# Altium project wind_monitor_v2.PrjPcb (part 3 of 3)

## Sheet connections.SchDoc
size A4; SheetNumber: 3; SheetTotal: 4
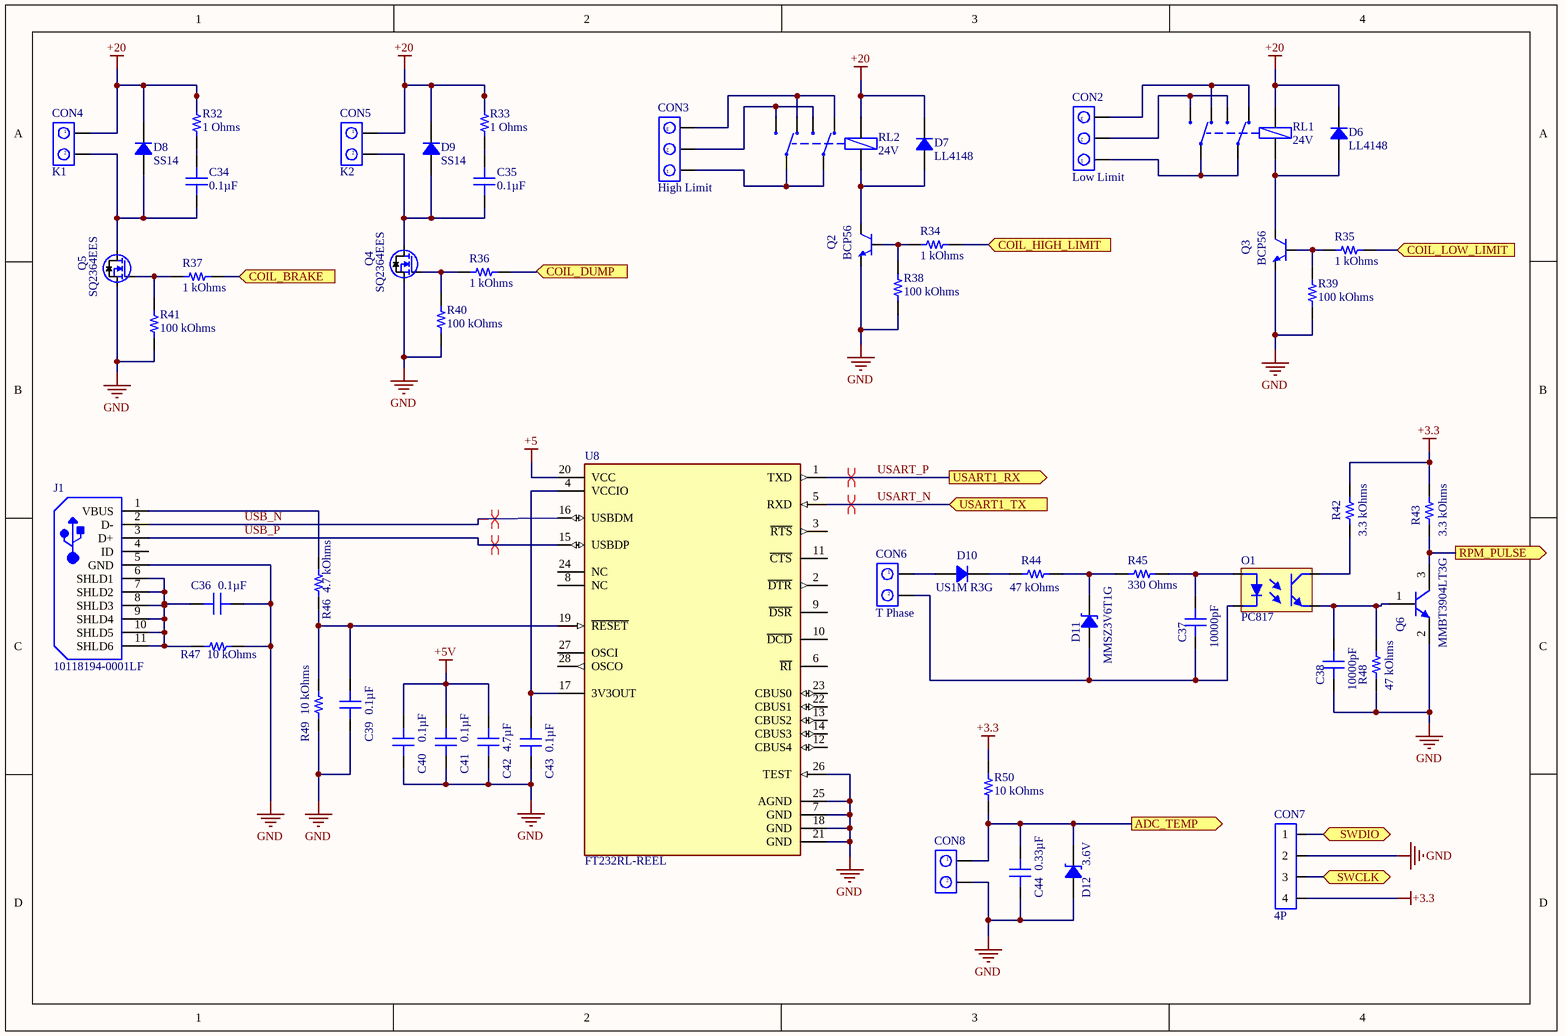
[diagram p2: connections.SchDoc]

### Parts
C34  0.1µF  [CAP 0805_2012]
C35  0.1µF  [CAP 0805_2012]
C36  0.1µF  [CAP 0402_1005]
C37  10000pF  [CAP 0805_2012]
C38  10000pF  [CAP 0805_2012]
C39  0.1µF  [CAP 0402_1005]
C40  0.1µF  [CAP 0402_1005]
C41  0.1µF  [CAP 0402_1005]
C42  4.7µF  [CAP 1206_3216 - 1.0MM]
C43  0.1µF  [CAP 0402_1005]
C44  0.33µF  [CAP 0805_2012]
CON2  Low Limit  [DG301-5.0-03P-12-00AH]
CON3  High Limit  [DG301-5.0-03P-12-00AH]
CON4  K1  [DG301-5.0-02P-12-00AH]
CON5  K2  [DG301-5.0-02P-12-00AH]
CON6  T Phase  [DG301-5.0-02P-12-00AH]
CON7  4P  [Single_THT_4P_2.54Pitch_6Height_180C]
CON8  DG301-5.0-02P-12-00AH  [DG301-5.0-02P-12-00AH]  (value not drawn)
D6  LL4148  [SOD-80 MiniMELF]
D7  LL4148  [SOD-80 MiniMELF]
D8  SS14  [DO214AC SMA]
D9  SS14  [DO214AC SMA]
D10  US1M R3G  [DO214AC SMA]
D11  MMSZ3V6T1G  [SOD-123]
D12  3.6V  [SOD-123]
J1  10118194-0001LF  [FCI-10118194-0001LF-5_V]
O1  PC817  [SMD-4]
Q2  BCP56  [SOT-223]
Q3  BCP56  [SOT-223]
Q4  SQ2364EES  [SOT23-(SQ2364EES)_H]
Q5  SQ2364EES  [SOT23-(SQ2364EES)_H]
Q6  MMBT3904LT3G  [ON SEMI SOT-23-3]
R32  1 Ohms  [RES 1206_3216]
R33  1 Ohms  [RES 1206_3216]
R34  1 kOhms  [RES 1206_3216]
R35  1 kOhms  [RES 1206_3216]
R36  1 kOhms  [RES 1206_3216]
R37  1 kOhms  [RES 1206_3216]
R38  100 kOhms  [RES 1206_3216]
R39  100 kOhms  [RES 1206_3216]
R40  100 kOhms  [RES 1206_3216]
R41  100 kOhms  [RES 1206_3216]
R42  3.3 kOhms  [RES 1206_3216]
R43  3.3 kOhms  [RES 1206_3216]
R44  47 kOhms  [RES 1206_3216]
R45  330 Ohms  [RES 1206_3216]
R46  4.7 kOhms  [RES 1206_3216]
R47  10 kOhms  [RES 1206_3216]
R48  47 kOhms  [RES 1206_3216]
R49  10 kOhms  [RES 1206_3216]
R50  10 kOhms  [RES 1206_3216]
RL1  24V  [HJR1-2C-L-24VDC-S-ZY]
RL2  24V  [HJR1-2C-L-24VDC-S-ZY]
U8  FT232RL-REEL  [FP-SSOP-28-IPC_B]

### Ports
ADC_TEMP (out), COIL_BRAKE (in), COIL_DUMP (in), COIL_HIGH_LIMIT (in), COIL_LOW_LIMIT (in), RPM_PULSE (out), SWCLK (bidir), SWDIO (bidir), USART1_RX (out), USART1_TX (in)

### Nets
+3.3: CON7.4 R42.2 R43.2 R50.2
+5: U8.20(VCC)
+5V: C40.2 C41.2 C42.2
+20: CON4.1 CON5.1 D6.2 D7.2 D8.2 D9.2 R32.2 R33.2 RL1.1(LEDK) RL2.1(LEDK)
GND: C36.1 C38.1 C39.1 C40.1 C41.1 C42.1 C43.1 C44.1 CON7.2 CON8.2 D12.1 J1.5(GND) Q2.3(E) Q3.3(E) Q4.2(S) Q5.2(S) Q6.2(E) R38.1 R39.1 R40.1 R41.1 R47.1 R48.1 R49.1 U8.7(GND) U8.18(GND) U8.21(GND) U8.25(AGND) U8.26(TEST)
USART_N: U8.5(RXD) ; port USART1_TX
USART_P: U8.1(TXD) ; port USART1_RX
USB_N: J1.2(D-) U8.16(USBDM)
USB_P: J1.3(D+) U8.15(USBDP)
NetC34_1: C34.1 CON4.2 D8.1 Q5.3(D)
NetC34_2: C34.2 R32.1
NetC35_1: C35.1 CON5.2 D9.1 Q4.3(D)
NetC35_2: C35.2 R33.1
NetC36_2: C36.2 J1.6(SHLD1) J1.7(SHLD2) J1.8(SHLD3) J1.9(SHLD4) J1.10(SHLD5) J1.11(SHLD6) R47.2
NetC37_1: C37.1 CON6.2 D11.1 O1.2
NetC37_2: C37.2 O1.1 R45.2
NetC38_2: C38.2 O1.3 Q6.1(B) R48.2
NetC39_2: C39.2 R46.1 R49.2 U8.19(~{RESET})
NetC43_2: C43.2 U8.4(VCCIO) U8.17(3V3OUT)
NetC44_2: C44.2 CON8.1 D12.2 R50.1 ; port ADC_TEMP
NetCON2_1: CON2.1 RL1.4 RL1.13
NetCON2_2: CON2.2 RL1.8 RL1.9
NetCON2_3: CON2.3 RL1.6 RL1.11
NetCON3_1: CON3.1 RL2.4 RL2.13
NetCON3_2: CON3.2 RL2.8 RL2.9
NetCON3_3: CON3.3 RL2.6 RL2.11
NetCON6_1: CON6.1 D10.1
NetCON7_1: CON7.1 ; port SWDIO
NetCON7_3: CON7.3 ; port SWCLK
NetD6_1: D6.1 Q3.2,4(C) RL1.16(LEDK)
NetD7_1: D7.1 Q2.2,4(C) RL2.16(LEDK)
NetD10_2: D10.2 R44.1
NetD11_2: D11.2 R44.2 R45.1
NetJ1_1: J1.1(VBUS) R46.2
NetO1_4: O1.4 R42.1
NetQ2_1: Q2.1(B) R34.1 R38.2
NetQ3_1: Q3.1(B) R35.1 R39.2
NetQ4_1: Q4.1(G) R36.1 R40.2
NetQ5_1: Q5.1(G) R37.1 R41.2
NetQ6_3: Q6.3(C) R43.1 ; port RPM_PULSE
NetR34_2: R34.2 ; port COIL_HIGH_LIMIT
NetR35_2: R35.2 ; port COIL_LOW_LIMIT
NetR36_2: R36.2 ; port COIL_DUMP
NetR37_2: R37.2 ; port COIL_BRAKE

Not connected (* = marked no-connect by the designer): J1 4(ID); U8 2(~{DTR}) 3(~{RTS}) 6(~{RI}) 8(NC) 9(~{DSR}) 10(~{DCD}) 11(~{CTS}) 12(CBUS4) 13(CBUS2) 14(CBUS3) 22(CBUS1) 23(CBUS0) 24(NC) 27(OSCI) 28(OSCO)

### Layout directives
differential pair; differential pair class usb: USB_N, USB_P
differential pair; differential pair class usart: USART_N, USART_P

### Library data of the parts
C34 C35 = AS0805KKX7R0BB104: CAP CER 0.1UF 100V X7R 0805; Manufacturer: Yageo; Tolerance: ±10%; Part Number: AS0805KKX7R0BB104; Value: 0.1µF; Applications: Automotive, Boardflex Sensitive; Capacitance: 0.1µF; ComponentLink1Description: Datasheet; ComponentLink1URL: http://www.yageo.com/NewPortal/yageodocoutput?fileName=/pdf/MLCC/UPY-AS_X7R_16V-to-630V_0.pdf; ComponentLink2Description: DigiKey Link; ComponentLink2URL: http://digikey.com/product-detail/en/yageo/AS0805KKX7R0BB104/311-4581-1-ND/8605488; Device Package: 0805 (2012 Metric); Features: Soft Termination; LastUpdated: 9/2/2020 1:04:41 AM; Lifecycle Status: Active; Minimum Order: 1; Mounting Type: Surface Mount, MLCC; Operating Temperature: -55°C ~ 125°C; Package / Case: 0805 (2012 Metric); Packaging: TapeAndReel; PartId: 2704; Part Status: Active; Price: 0.08; Ratings: AEC-Q200; Series: AS; Size / Dimension: 0.079" L x 0.049" W (2.00mm x 1.25mm); Supplier 1: DigiKey; Supplier Part Number 1: 311-4581-1-ND; Temperature Coefficient: X7R; Thickness (Max): 0.057" (1.45mm); Voltage - Rated: 100V
C36 C39-C41 C43 = C0402C104M4RACTU: CAP CER 0.1UF 16V X7R 0402; Manufacturer: KEMET; Tolerance: ±20%; Part Number: C0402C104M4RACTU; Value: 0.1µF; Applications: Bypass, Decoupling; Capacitance: 0.1µF; ComponentLink1Description: Datasheet; ComponentLink1URL: https://api.kemet.com/component-edge/download/datasheet/C0402C104M4RACTU.pdf; ComponentLink2Description: DigiKey Link; ComponentLink2URL: http://digikey.com/product-detail/en/kemet/C0402C104M4RACTU/399-7763-1-ND/3471486; Device Package: 0402 (1005 Metric); LastUpdated: 9/2/2020 1:02:24 AM; Lifecycle Status: Active; Minimum Order: 1; Mounting Type: Surface Mount, MLCC; Operating Temperature: -55°C ~ 125°C; Package / Case: 0402 (1005 Metric); Packaging: TapeAndReel; PartId: 2095; Part Status: Active; Price: 0.02; Series: SMD Comm X7R; Size / Dimension: 0.039" L x 0.020" W (1.00mm x 0.50mm); Supplier 1: DigiKey; Supplier Part Number 1: 399-7763-1-ND; Temperature Coefficient: X7R; Thickness (Max): 0.022" (0.55mm); Voltage - Rated: 16V
C37 C38 = C0805X103K1RAC3316: CAP CER 0805 10NF 100V X7R; Manufacturer: KEMET; Tolerance: ±10%; Part Number: C0805X103K1RAC3316; Value: 10000pF; Applications: Automotive, Boardflex Sensitive; Capacitance: 10000pF; ComponentLink1Description: Datasheet; ComponentLink1URL: https://api.kemet.com/component-edge/download/datasheet/C0805X103K1RAC3316.pdf; ComponentLink2Description: DigiKey Link; ComponentLink2URL: http://digikey.com/product-detail/en/kemet/C0805X103K1RAC3316/399-C0805X103K1RAC3316CT-ND/10315836; Device Package: 0805 (2012 Metric); Features: Soft Termination; LastUpdated: 9/2/2020 1:04:42 AM; Lifecycle Status: Active; Minimum Order: 1; Mounting Type: Surface Mount, MLCC; Operating Temperature: -55°C ~ 125°C; Package / Case: 0805 (2012 Metric); Packaging: TapeAndReel; PartId: 2565; Part Status: Active; Price: 0.02; Ratings: AEC-Q200; Series: SMD Auto X7R VW80808; Size / Dimension: 0.079" L x 0.049" W (2.00mm x 1.25mm); Supplier 1: DigiKey; Supplier Part Number 1: 399-C0805X103K1RAC3316CT-ND; Temperature Coefficient: X7R; Thickness (Max): 0.039" (0.98mm); Voltage - Rated: 100V
C42 = C3216X7R1E475K085AB: CAP CER 4.7UF 25V X7R 1206; Manufacturer: TDK Corporation; Tolerance: ±10%; Part Number: C3216X7R1E475K085AB; Value: 4.7µF; Applications: General Purpose; Capacitance: 4.7µF; ComponentLink1Description: Datasheet; ComponentLink1URL: https://product.tdk.com/info/en/catalog/datasheets/mlcc_commercial_general_en.pdf?ref_disty=digikey; ComponentLink2Description: DigiKey Link; ComponentLink2URL: http://digikey.com/product-detail/en/tdk-corporation/C3216X7R1E475K085AB/445-14797-1-ND/3956463; Device Package: 1206 (3216 Metric); Features: Low ESL; LastUpdated: 9/2/2020 1:05:06 AM; Lifecycle Status: Active; Minimum Order: 1; Mounting Type: Surface Mount, MLCC; Operating Temperature: -55°C ~ 125°C; Package / Case: 1206 (3216 Metric); Packaging: TapeAndReel; PartId: 19105; Part Status: Active; Price: 0.08; Series: C; Size / Dimension: 0.126" L x 0.063" W (3.20mm x 1.60mm); Supplier 1: DigiKey; Supplier Part Number 1: 445-14797-1-ND; Temperature Coefficient: X7R; Thickness (Max): 0.039" (1.00mm); Voltage - Rated: 25V
C44 = C0805C334K5RECAUTO: CAP CER 0805 330NF 50V X7R 10%; Manufacturer: KEMET; Part Number: C0805C334K5RECAUTO; Value: 0.33µF; Applications: Automotive, ESD Protection; Capacitance: 0.33µF; ComponentLink1Description: Datasheet; ComponentLink1URL: https://api.kemet.com/component-edge/download/datasheet/C0805C334K5RECAUTO.pdf; ComponentLink2Description: DigiKey Link; ComponentLink2URL: http://digikey.com/product-detail/en/kemet/C0805C334K5RECAUTO/399-17888-1-ND/8640555; Device Package: 0805 (2012 Metric); LastUpdated: 9/2/2020 1:04:15 AM; Lifecycle Status: Active; Minimum Order: 1; Mounting Type: Surface Mount, MLCC; Operating Temperature: -55°C ~ 125°C; Package / Case: 0805 (2012 Metric); Packaging: TapeAndReel; PartId: 15715; Part Status: Active; Price: 0.05; Ratings: AEC-Q200; Series: ESD SMD Auto X7R; Size / Dimension: 0.079" L x 0.049" W (2.00mm x 1.25mm); Supplier 1: DigiKey; Supplier Part Number 1: 399-17888-1-ND; Temperature Coefficient: X7R; Thickness (Max): 0.039" (1.00mm); Tolerance: ±10%; Voltage - Rated: 50V
CON2 CON3 = DG301-5.0-03P-12-00AH
CON4-CON6 = DG301-5.0-02P-12-00AH
CON7 = Single 4P 2.54mm
D6 D7 = LL4148: DIODE GEN PURP 100V 200MA SOD80; Manufacturer: ON Semiconductor; Current - Reverse Leakage @ Vr: 25nA @ 20V; Diode Type: Standard; Reverse Recovery Time (trr): 4ns; Speed: Small Signal =< 200mA (Io), Any Speed; Voltage - Forward (Vf) (Max) @ If: 1V @ 10mA; Part Number: LL4148; ComponentLink1Description: Datasheet; ComponentLink1URL: https://www.onsemi.com/pub/Collateral/LL4148-D.pdf; ComponentLink2Description: DigiKey Link; ComponentLink2URL: http://digikey.com/product-detail/en/on-semiconductor/LL4148/LL4148FSCT-ND/1923118; Current - Average Rectified (Io): 200mA; LastUpdated: 9/2/2020 1:23:17 AM; Lifecycle Status: Active; Minimum Order: 1; Mounting Type: Surface Mount; Operating Temperature - Junction: -55°C ~ 175°C; Package / Case: DO-213AC, MINI-MELF, SOD-80; Packaging: TapeAndReel; PartId: 2621; Part Status: Active; Price: 0.02; Series: -; Supplier 1: DigiKey; Supplier Part Number 1: LL4148FSCT-ND; Supplier Device Package: SOD-80; Voltage - DC Reverse (Vr) (Max): 100V
D8 D9 = SS14: DIODE SCHOTTKY 40V 1A SMA; Manufacturer: ON Semiconductor; Current - Reverse Leakage @ Vr: 200µA @ 40V; Speed: Fast Recovery =< 500ns, > 200mA (Io); Voltage - Forward (Vf) (Max) @ If: 500mV @ 1A; Part Number: SS14; ComponentLink1Description: Datasheet; ComponentLink1URL: https://www.onsemi.com/pub/Collateral/SS19-D.PDF; ComponentLink2Description: DigiKey Link; ComponentLink2URL: http://digikey.com/product-detail/en/on-semiconductor/SS14/SS14CT-ND/965729; Current - Average Rectified (Io): 1A; Diode Type: Schottky; LastUpdated: 9/2/2020 1:19:04 AM; Lifecycle Status: Active; Minimum Order: 1; Mounting Type: Surface Mount; Operating Temperature - Junction: -65°C ~ 125°C; Package / Case: DO-214AC, SMA; Packaging: TapeAndReel; PartId: 1885; Part Status: Active; Price: 0.06; Series: -; Supplier 1: DigiKey; Supplier Part Number 1: SS14CT-ND; Supplier Device Package: SMA (DO-214AC); Voltage - DC Reverse (Vr) (Max): 40V
D10 = US1M R3G: DIODE GEN PURP 1KV 1A DO214AC; Manufacturer: Taiwan Semiconductor Corporation; Capacitance @ Vr, F: 10pF @ 4V, 1MHz; Current - Reverse Leakage @ Vr: 5µA @ 1000V; Diode Type: Standard; Reverse Recovery Time (trr): 75ns; Speed: Fast Recovery =< 500ns, > 200mA (Io); Voltage - DC Reverse (Vr) (Max): 1000V; Voltage - Forward (Vf) (Max) @ If: 1.7V @ 1A; Part Number: US1M R3G; ComponentLink1Description: Datasheet; ComponentLink1URL: https://www.taiwansemi.com/products/datasheet/US1A%20SERIES_M15.pdf; ComponentLink2Description: DigiKey Link; ComponentLink2URL: http://digikey.com/product-detail/en/taiwan-semiconductor-corporation/US1M-R3G/US1MR3GCT-ND/7360852; Current - Average Rectified (Io): 1A; LastUpdated: 9/2/2020 1:19:04 AM; Lifecycle Status: Active; Minimum Order: 1; Mounting Type: Surface Mount; Operating Temperature - Junction: -55°C ~ 150°C; Package / Case: DO-214AC, SMA; Packaging: TapeAndReel; PartId: 605; Part Status: Active; Price: 0.08; Series: -; Supplier 1: DigiKey; Supplier Part Number 1: US1MR3GCT-ND; Supplier Device Package: DO-214AC (SMA)
D11 D12 = MMSZ3V6T1G: DIODE ZENER 3.6V 500MW SOD123; Manufacturer: ON Semiconductor; Current - Reverse Leakage @ Vr: 5µA @ 1V; Impedance (Max) (Zzt): 90 Ohms; Tolerance: ±5%; Voltage - Forward (Vf) (Max) @ If: 900mV @ 10mA; Part Number: MMSZ3V6T1G; ComponentLink1Description: Datasheet; ComponentLink1URL: http://www.onsemi.com/pub/Collateral/MMSZ2V4T1-D.PDF; ComponentLink2Description: DigiKey Link; ComponentLink2URL: http://digikey.com/product-detail/en/on-semiconductor/MMSZ3V6T1G/MMSZ3V6T1GOSCT-ND/2121110; LastUpdated: 9/2/2020 1:19:27 AM; Lifecycle Status: Active; Minimum Order: 1; Mounting Type: Surface Mount; Operating Temperature: -55°C ~ 150°C; Package / Case: SOD-123; Packaging: TapeAndReel; PartId: 1892; Part Status: Active; Power - Max: 500mW; Price: 0.04; Series: -; Supplier 1: DigiKey; Supplier Part Number 1: MMSZ3V6T1GOSCT-ND; Supplier Device Package: SOD-123; Voltage - Zener (Nom) (Vz): 3.6V
J1 = KLS1-238: Micro USB B Type Receptacle, 1.8 A, -55 to 85 degC, 5-Pin SMD, RoHS, Tape and Reel; Manufacturer: Amphenol FCI; Body Orientation: RightAngle; Number of Contacts: 5; Pitch: 0.65mm; Gender: RCP; Rad Hard: No; Package Reference: 10118194-0001LF-5; Mounting: SurfaceMount; Manufacturer URL: http://www.fci.com/; Packaging: CutTape; Datasheet URL: https://datasheet.ciiva.com/26945/getdatasheetpartid-418619-26945695.pdf; Termination Method: Solder; Package Description: 5-Pin Surface Mount Device, Body 8.05 x 5.53 mm, Pitch 0.65 mm; Type: MicroUSBTypeB; Datasheet Version: Rev. A, 10/2011
O1 = PC817A: Optoisolator Transistor Output 5000Vrms 1 Channel 4-DIP; MF: Taiwan Semiconductor; Availability: Unavailable; Package: DIP-4 Taiwan Semiconductor; SnapEDA_Link: https://www.snapeda.com/parts/PC817A/Taiwan%20Semiconductor%20Corporation/view-part/2178336/?ref=snap; MP: PC817A; Price: None; Value: *
Q2 Q3 = BCP56-16T1G: Trans GP BJT NPN 80V 1A Automotive 4-Pin(3+Tab) SOT-223 T/R; Manufacturer: ON Semiconductor; Max Power Dissipation: 1.5W; Collector Base Voltage (VCBO): 100V; Emitter Base Voltage (VEBO): 5V; Element Configuration: Single; Collector Emitter Saturation Voltage: 500mV; Transition Frequency: 130MHz; Number of Elements: 1; hFE Min: 25; Supplier 1: Digi-Key; Manufacturer Part Number: BCP56-16T1G; RoHS: Yes; Category: BJTs; Stock 1: 31080; Pricing 1: 1=0.48000, 10=0.33400, 25=0.31080, 100=0.16880, 500=0.13768 (USD); Case/Package: SOT-223-4; Number of Pins: 4; Contact Plating: Tin,Matte; Min Operating Temperature: -65°C; Max Operating Temperature: 150°C; Packaging: Tape and Reel; Collector Emitter Voltage (VCEO): 80V; Max Collector Current: 1A; Polarity: NPN; Package Quantity: 1000; Collector Emitter Breakdown Voltage: 80V; Max Breakdown Voltage: 80V; Gain Bandwidth Product: 130MHz; Collector-emitter Voltage-Max: 500mV; Power Dissipation: 1.5W; Series: -; Frequency: 130MHz; Voltage Rating (DC): 80V; Current Rating: 1A; Max Frequency: 130MHz; Length: 6.5mm; Width: 3.5mm; Height: 1.57mm; Radiation Hardening: No; Lead Free: Lead Free; RoHS Compliant: Yes; REACH SVHC: No SVHC; ComponentLink1URL: https://datasheet.ciiva.com/15139/getdatasheetpartid-110207-15139278.pdf?src-supplier=Verical; ComponentLink1Description: https://datasheet.ciiva.com/15139/getdatasheetpartid-110207-15139278.pdf?src-supplier=Verical; ComponentLink2URL: https://datasheet.ciiva.com/976/bcp56t1-d-976689.pdf?src-supplier=Digi-Key; ComponentLink2Description: https://datasheet.ciiva.com/976/bcp56t1-d-976689.pdf?src-supplier=Digi-Key; ComponentLink3URL: https://datasheet.ciiva.com/976/bcp56t1-d-976690.pdf?src-supplier=Digi-Key; ComponentLink3Description: https://datasheet.ciiva.com/976/bcp56t1-d-976690.pdf?src-supplier=Digi-Key; ComponentLink4URL: https://datasheet.ciiva.com/976/bcp56t1-d-976691.pdf?src-supplier=Digi-Key; ComponentLink4Description: https://datasheet.ciiva.com/976/bcp56t1-d-976691.pdf?src-supplier=Digi-Key; ComponentLink5URL: https://datasheet.ciiva.com/16218/bcp56t1-d-16218471.pdf?src-supplier=Future+Electronics; ComponentLink5Description: https://datasheet.ciiva.com/16218/bcp56t1-d-16218471.pdf?src-supplier=Future+Electronics; ComponentLink6URL: https://datasheet.ciiva.com/16478/bcp56t1-d-16478825.pdf?src-supplier=Avnet+Asia; ComponentLink6Description: https://datasheet.ciiva.com/16478/bcp56t1-d-16478825.pdf?src-supplier=Avnet+Asia; ComponentLink7URL: https://datasheet.ciiva.com/11198/bcp56t1-d-11198028.pdf?src-supplier=Avnet; ComponentLink7Description: https://datasheet.ciiva.com/11198/bcp56t1-d-11198028.pdf?src-supplier=Avnet
Q4 Q5 = SQ2364EES: Trans MOSFET N-CH 60V 2A Automotive 3-Pin SOT-23 T/R; Manufacturer: Vishay; Manufacturer Part Number: SQ2364EES-T1_GE3; Supplier 1: Digi-Key; RoHS: No; Stock 1: 15433; Pricing 1: 1=0.61000, 10=0.52300, 25=0.48960, 100=0.36380, 500=0.28404, 1000=0.23087 (USD); ComponentLink1URL: http://www.farnell.com/datasheets/2611857.pdf?src-supplier=Farnell; ComponentLink1Description: http://www.farnell.com/datasheets/2611857.pdf?src-supplier=Farnell; ComponentLink2URL: http://www.farnell.com/datasheets/2611857.pdf?src-supplier=Newark; ComponentLink2Description: http://www.farnell.com/datasheets/2611857.pdf?src-supplier=Newark
Q6 = MMBT3904LT3G: TRANS NPN 40V 0.2A SOT23; Manufacturer: ON Semiconductor; Current - Collector (Ic) (Max): 200mA; DC Current Gain (hFE) (Min) @ Ic, Vce: 100 @ 10mA, 1V; Frequency - Transition: 300MHz; Power - Max: 300mW; Vce Saturation (Max) @ Ib, Ic: 300mV @ 5mA, 50mA; Part Number: MMBT3904LT3G; ComponentLink1Description: Datasheet; ComponentLink1URL: http://www.onsemi.com/pub/Collateral/MMBT3904LT1-D.PDF; ComponentLink2Description: DigiKey Link; ComponentLink2URL: http://digikey.com/product-detail/en/on-semiconductor/MMBT3904LT3G/MMBT3904LT3GOSCT-ND/1139814; LastUpdated: 9/2/2020 1:30:08 AM; Lifecycle Status: Active; Minimum Order: 1; Mounting Type: Surface Mount; Operating Temperature: -55°C ~ 150°C (TJ); Package / Case: TO-236-3, SC-59, SOT-23-3; Packaging: TapeAndReel; PartId: 159; Part Status: Active; Price: 0.02; Supplier 1: DigiKey; Supplier Part Number 1: MMBT3904LT3GOSCT-ND; Supplier Device Package: SOT-23-3 (TO-236); Transistor Type: NPN; Voltage - Collector Emitter Breakdown (Max): 40V
R32 R33 = RK73H2BTTD1R00F: RES 1 OHM 1% 1/4W 1206; Manufacturer: KOA Speer Electronics, Inc.; Power (Watts): 0.25W, 1/4W; Temperature Coefficient: ±200ppm/°C; Part Number: RK73H2BTTD1R00F; ComponentLink1Description: Datasheet; ComponentLink1URL: http://www.koaspeer.com/catimages/Products/RK73H/RK73H.pdf; ComponentLink2Description: DigiKey Link; ComponentLink2URL: http://digikey.com/product-detail/en/koa-speer-electronics-inc/RK73H2BTTD1R00F/2019-RK73H2BTTD1R00FCT-ND/10237170; Composition: Thick Film; Device Package: 1206 (3216 Metric); Features: Automotive AEC-Q200, Moisture Resistant; Height - Seated (Max): 0.028" (0.70mm); LastUpdated: 9/2/2020 1:13:09 AM; Lifecycle Status: Active; Minimum Order: 1; Number of Terminations: 2; Operating Temperature: -55°C ~ 155°C; Package / Case: 1206 (3216 Metric); Packaging: TapeAndReel; PartId: 27219; Part Status: Active; Price: 0.01; Ratings: AEC-Q200; Resistance: 1 Ohms; Series: RK73H; Size / Dimension: 0.126" L x 0.063" W (3.20mm x 1.60mm); Supplier 1: DigiKey; Supplier Part Number 1: 2019-RK73H2BTTD1R00FCT-ND; Supplier Device Package: 1206; Tolerance: ±1%; Value: 1 Ohms
R34-R37 = RC1206FR-071KL: RES SMD 1K OHM 1% 1/4W 1206; Manufacturer: Yageo; Power (Watts): 0.25W, 1/4W; Temperature Coefficient: ±100ppm/°C; Part Number: RC1206FR-071KL; ComponentLink1Description: Datasheet; ComponentLink1URL: https://www.yageo.com/upload/media/product/productsearch/datasheet/rchip/PYu-RC_Group_51_RoHS_L_10.pdf; ComponentLink2Description: DigiKey Link; ComponentLink2URL: http://digikey.com/product-detail/en/yageo/RC1206FR-071KL/311-1.00KFRCT-ND/731334; Composition: Thick Film; Device Package: 1206 (3216 Metric); Features: Moisture Resistant; Height - Seated (Max): 0.026" (0.65mm); LastUpdated: 9/2/2020 1:13:10 AM; Lifecycle Status: Active; Minimum Order: 1; Number of Terminations: 2; Operating Temperature: -55°C ~ 155°C; Package / Case: 1206 (3216 Metric); Packaging: TapeAndReel; PartId: 26978; Part Status: Active; Price: 0.01; Resistance: 1 kOhms; Series: RC; Size / Dimension: 0.122" L x 0.063" W (3.10mm x 1.60mm); Supplier 1: DigiKey; Supplier Part Number 1: 311-1.00KFRCT-ND; Supplier Device Package: 1206; Tolerance: ±1%; Value: 1 kOhms
R38-R41 = CRG1206F100K: RES SMD 100K OHM 1% 1/4W 1206; Manufacturer: TE Connectivity Passive Product; Power (Watts): 0.25W, 1/4W; Temperature Coefficient: ±100ppm/°C; Part Number: CRG1206F100K; ComponentLink1Description: Datasheet; ComponentLink1URL: https://www.te.com/commerce/DocumentDelivery/DDEController?Action=srchrtrv&DocNm=1773204&DocType=DS&DocLang=English; ComponentLink2Description: DigiKey Link; ComponentLink2URL: http://digikey.com/product-detail/en/te-connectivity-passive-product/CRG1206F100K/A106067CT-ND/3477717; Composition: Thick Film; Device Package: 1206 (3216 Metric); Height - Seated (Max): 0.026" (0.65mm); LastUpdated: 9/2/2020 1:13:10 AM; Lifecycle Status: Active; Minimum Order: 1; Number of Terminations: 2; Operating Temperature: -55°C ~ 155°C; Package / Case: 1206 (3216 Metric); Packaging: TapeAndReel; PartId: 26988; Part Status: Active; Price: 0.01; Resistance: 100 kOhms; Series: CRG, Neohm; Size / Dimension: 0.122" L x 0.061" W (3.10mm x 1.55mm); Supplier 1: DigiKey; Supplier Part Number 1: A106067CT-ND; Supplier Device Package: 1206; Tolerance: ±1%; Value: 100 kOhms
R42 R43 = CRCW12063K30FKEA: RES SMD 3.3K OHM 1% 1/4W 1206; Manufacturer: Vishay Dale; Power (Watts): 0.25W, 1/4W; Temperature Coefficient: ±100ppm/°C; Part Number: CRCW12063K30FKEA; ComponentLink1Description: Datasheet; ComponentLink1URL: http://www.vishay.com/docs/20035/dcrcwe3.pdf; ComponentLink2Description: DigiKey Link; ComponentLink2URL: http://digikey.com/product-detail/en/vishay-dale/CRCW12063K30FKEA/541-3.30KFCT-ND/1181817; Composition: Thick Film; Device Package: 1206 (3216 Metric); Features: Automotive AEC-Q200; Height - Seated (Max): 0.024" (0.60mm); LastUpdated: 9/2/2020 1:13:06 AM; Lifecycle Status: Active; Minimum Order: 1; Number of Terminations: 2; Operating Temperature: -55°C ~ 155°C; Package / Case: 1206 (3216 Metric); Packaging: TapeAndReel; PartId: 28070; Part Status: Active; Price: 0.01; Ratings: AEC-Q200; Resistance: 3.3 kOhms; Series: CRCW; Size / Dimension: 0.126" L x 0.063" W (3.20mm x 1.60mm); Supplier 1: DigiKey; Supplier Part Number 1: 541-3.30KFCT-ND; Supplier Device Package: 1206; Tolerance: ±1%; Value: 3.3 kOhms
R44 R48 = AC1206FR-0747KL: RES SMD 47K OHM 1% 1/4W 1206; Manufacturer: Yageo; Power (Watts): 0.25W, 1/4W; Temperature Coefficient: ±100ppm/°C; Part Number: AC1206FR-0747KL; ComponentLink1Description: Datasheet; ComponentLink1URL: https://www.yageo.com/upload/media/product/productsearch/datasheet/rchip/PYu-AC_51_RoHS_L_7.pdf; ComponentLink2Description: DigiKey Link; ComponentLink2URL: http://digikey.com/product-detail/en/yageo/AC1206FR-0747KL/YAG3880CT-ND/6006729; Composition: Thick Film; Device Package: 1206 (3216 Metric); Features: Automotive AEC-Q200, Moisture Resistant; Height - Seated (Max): 0.026" (0.65mm); LastUpdated: 9/2/2020 1:12:59 AM; Lifecycle Status: Active; Minimum Order: 1; Number of Terminations: 2; Operating Temperature: -55°C ~ 155°C; Package / Case: 1206 (3216 Metric); Packaging: TapeAndReel; PartId: 31157; Part Status: Active; Price: 0.01; Ratings: AEC-Q200; Resistance: 47 kOhms; Series: AC; Size / Dimension: 0.122" L x 0.063" W (3.10mm x 1.60mm); Supplier 1: DigiKey; Supplier Part Number 1: YAG3880CT-ND; Supplier Device Package: 1206; Tolerance: ±1%; Value: 47 kOhms
R45 = CRCW1206330RFKEA: RES SMD 330 OHM 1% 1/4W 1206; Manufacturer: Vishay Dale; Power (Watts): 0.25W, 1/4W; Temperature Coefficient: ±100ppm/°C; Part Number: CRCW1206330RFKEA; ComponentLink1Description: Datasheet; ComponentLink1URL: http://www.vishay.com/docs/20035/dcrcwe3.pdf; ComponentLink2Description: DigiKey Link; ComponentLink2URL: http://digikey.com/product-detail/en/vishay-dale/CRCW1206330RFKEA/541-330FCT-ND/1181703; Composition: Thick Film; Device Package: 1206 (3216 Metric); Features: Automotive AEC-Q200; Height - Seated (Max): 0.024" (0.60mm); LastUpdated: 9/2/2020 1:12:58 AM; Lifecycle Status: Active; Minimum Order: 1; Number of Terminations: 2; Operating Temperature: -55°C ~ 155°C; Package / Case: 1206 (3216 Metric); Packaging: TapeAndReel; PartId: 31558; Part Status: Active; Price: 0.01; Ratings: AEC-Q200; Resistance: 330 Ohms; Series: CRCW; Size / Dimension: 0.126" L x 0.063" W (3.20mm x 1.60mm); Supplier 1: DigiKey; Supplier Part Number 1: 541-330FCT-ND; Supplier Device Package: 1206; Tolerance: ±1%; Value: 330 Ohms
R46 = CRG1206F4K7: RES SMD 4.7K OHM 1% 1/4W 1206; Manufacturer: TE Connectivity Passive Product; Power (Watts): 0.25W, 1/4W; Temperature Coefficient: ±100ppm/°C; Part Number: CRG1206F4K7; ComponentLink1Description: Datasheet; ComponentLink1URL: https://www.te.com/commerce/DocumentDelivery/DDEController?Action=srchrtrv&DocNm=1773204&DocType=DS&DocLang=English; ComponentLink2Description: DigiKey Link; ComponentLink2URL: http://digikey.com/product-detail/en/te-connectivity-passive-product/CRG1206F4K7/A106078CT-ND/3477735; Composition: Thick Film; Device Package: 1206 (3216 Metric); Height - Seated (Max): 0.026" (0.65mm); LastUpdated: 9/2/2020 1:13:10 AM; Lifecycle Status: Active; Minimum Order: 1; Number of Terminations: 2; Operating Temperature: -55°C ~ 155°C; Package / Case: 1206 (3216 Metric); Packaging: TapeAndReel; PartId: 26987; Part Status: Active; Price: 0.01; Resistance: 4.7 kOhms; Series: CRG, Neohm; Size / Dimension: 0.122" L x 0.061" W (3.10mm x 1.55mm); Supplier 1: DigiKey; Supplier Part Number 1: A106078CT-ND; Supplier Device Package: 1206; Tolerance: ±1%; Value: 4.7 kOhms
R47 R49 = CRG1206F10K: RES SMD 10K OHM 1% 1/4W 1206; Manufacturer: TE Connectivity Passive Product; Power (Watts): 0.25W, 1/4W; Temperature Coefficient: ±100ppm/°C; Part Number: CRG1206F10K; ComponentLink1Description: Datasheet; ComponentLink1URL: https://www.te.com/commerce/DocumentDelivery/DDEController?Action=srchrtrv&DocNm=1773204&DocType=DS&DocLang=English; ComponentLink2Description: DigiKey Link; ComponentLink2URL: http://digikey.com/product-detail/en/te-connectivity-passive-product/CRG1206F10K/A106069CT-ND/3477720; Composition: Thick Film; Device Package: 1206 (3216 Metric); Height - Seated (Max): 0.026" (0.65mm); LastUpdated: 9/2/2020 1:13:10 AM; Lifecycle Status: Active; Minimum Order: 1; Number of Terminations: 2; Operating Temperature: -55°C ~ 155°C; Package / Case: 1206 (3216 Metric); Packaging: TapeAndReel; PartId: 26989; Part Status: Active; Price: 0.01; Resistance: 10 kOhms; Series: CRG, Neohm; Size / Dimension: 0.122" L x 0.061" W (3.10mm x 1.55mm); Supplier 1: DigiKey; Supplier Part Number 1: A106069CT-ND; Supplier Device Package: 1206; Tolerance: ±1%; Value: 10 kOhms
R50 = CRGCQ1206F10K: CRGCQ 1206 10K 1%; Manufacturer: TE Connectivity Passive Product; Power (Watts): 0.25W, 1/4W; Temperature Coefficient: ±100ppm/°C; Part Number: CRGCQ1206F10K; ComponentLink1Description: Datasheet; ComponentLink1URL: https://www.te.com/commerce/DocumentDelivery/DDEController?Action=srchrtrv&DocNm=1773204-3&DocType=DS&DocLang=English; ComponentLink2Description: DigiKey Link; ComponentLink2URL: http://digikey.com/product-detail/en/te-connectivity-passive-product/CRGCQ1206F10K/A129822CT-ND/8577654; Composition: Thick Film; Device Package: 1206 (3216 Metric); Features: Automotive AEC-Q200, Moisture Resistant; Height - Seated (Max): 0.026" (0.65mm); LastUpdated: 9/2/2020 1:13:10 AM; Lifecycle Status: Active; Minimum Order: 1; Number of Terminations: 2; Operating Temperature: -55°C ~ 155°C; Package / Case: 1206 (3216 Metric); Packaging: TapeAndReel; PartId: 27005; Part Status: Active; Price: 0.01; Ratings: AEC-Q200; Resistance: 10 kOhms; Series: CRGCQ; Size / Dimension: 0.122" L x 0.061" W (3.10mm x 1.55mm); Supplier 1: DigiKey; Supplier Part Number 1: A129822CT-ND; Supplier Device Package: 1206; Tolerance: ±1%; Value: 10 kOhms
RL1 RL2 = HJR1-2C-L-24VDC-S-ZY: 24V 2A 2Z contact DPDT Telecom relay; Value: 24V
U8 = FT232R: IC USB FS SERIAL UART 28-SSOP; Data Rate: 12Mbps; Max Supply Voltage: 5.25V; Operating Supply Current: 15mA; Number of Channels: 1; Voltage: 5V; Min Supply Voltage: 3.3V; Radiation Hardening: No; Mount: Surface Mount; Min Operating Temperature: -40°C; Package Quantity: 2000; Number of Transceivers: 1; Width: 5.3mm; Number of Pins: 28; Height: 1.75mm; Weight: 0.080001oz; Lead Free: Lead Free; Length: 10.2mm; REACH SVHC: No SVHC; Max Operating Temperature: 85°C; Packaging: Tape and Reel; Interface: UART; Case/Package: SSOP

## Sheet current sense.SchDoc
size A4; SheetNumber: 4; SheetTotal: 4
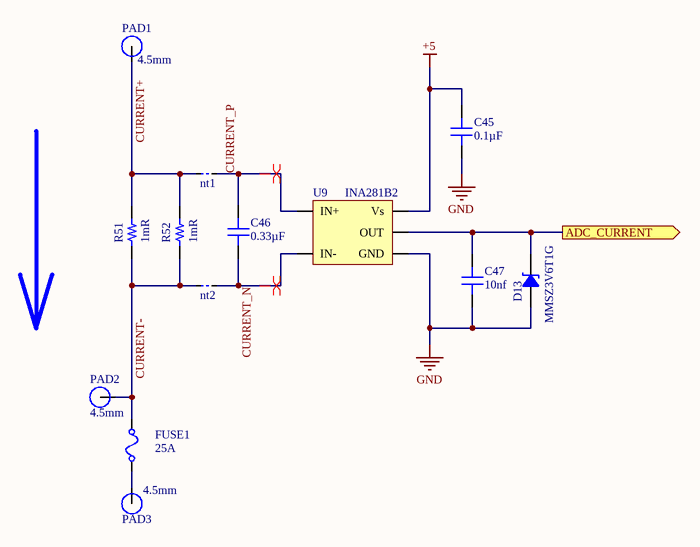
[diagram p3: current sense.SchDoc]

### Parts
C45  0.1µF  [CAP 0805_2012]
C46  0.33µF  [CAP 0805_2012]
C47  10nf  [CAP 0805_2012]
D13  MMSZ3V6T1G  [SOD-123]
FUSE1  25A  [3522 ATOF FUSE]
nt1  NET TIE 2  [0.3mm]  (value not drawn)  (net tie, no BOM)
nt2  NET TIE 2  [0.3mm]  (value not drawn)  (net tie, no BOM)
PAD1  4.5mm  [Single Pad 4.5mm]
PAD2  4.5mm  [Single Pad 4.5mm]
PAD3  4.5mm  [Single Pad 4.5mm]
R51  1mR  [2512_bvt]
R52  1mR  [2512_bvt]
U9  INA281B2  [SOT-23(INA281)_H]

### Ports
ADC_CURRENT (out)

### Nets
+5: C45.2 U9.3(Vs)
GND: C45.1 C47.1 D13.1 U9.2(GND)
CURRENT+: nt1.1 PAD1.1 R51.2 R52.2
CURRENT-: FUSE1.2 nt2.1 PAD2.1 R51.1 R52.1
CURRENT_N: C46.1 nt2.2 U9.5(IN-)
CURRENT_P: C46.2 nt1.2 U9.4(IN+)
NetC47_2: C47.2 D13.2 U9.1(OUT) ; port ADC_CURRENT
NetFUSE1_1: FUSE1.1 PAD3.1

### Layout directives
differential pair; differential pair class current: CURRENT_N, CURRENT_P

### Library data of the parts
C45 = AS0805KKX7R0BB104: as C34 on sheet connections; Part Number: AS0805KKX7R0BB104; Value: 0.1µF; Applications: Automotive, Boardflex Sensitive; Capacitance: 0.1µF; ComponentLink1Description: Datasheet; ComponentLink1URL: http://www.yageo.com/NewPortal/yageodocoutput?fileName=/pdf/MLCC/UPY-AS_X7R_16V-to-630V_0.pdf; ComponentLink2Description: DigiKey Link; ComponentLink2URL: http://digikey.com/product-detail/en/yageo/AS0805KKX7R0BB104/311-4581-1-ND/8605488; Device Package: 0805 (2012 Metric); Features: Soft Termination; LastUpdated: 9/2/2020 1:04:41 AM; Lifecycle Status: Active; Minimum Order: 1; Mounting Type: Surface Mount, MLCC; Operating Temperature: -55°C ~ 125°C; Package / Case: 0805 (2012 Metric); Packaging: TapeAndReel; PartId: 2704; Part Status: Active; Price: 0.08; Ratings: AEC-Q200; Series: AS; Size / Dimension: 0.079" L x 0.049" W (2.00mm x 1.25mm); Supplier 1: DigiKey; Supplier Part Number 1: 311-4581-1-ND; Temperature Coefficient: X7R; Thickness (Max): 0.057" (1.45mm); Voltage - Rated: 100V
C46 = C0805C334K5RECAUTO: as C44 on sheet connections; Part Number: C0805C334K5RECAUTO; Value: 0.33µF; Applications: Automotive, ESD Protection; Capacitance: 0.33µF; ComponentLink1Description: Datasheet; ComponentLink1URL: https://api.kemet.com/component-edge/download/datasheet/C0805C334K5RECAUTO.pdf; ComponentLink2Description: DigiKey Link; ComponentLink2URL: http://digikey.com/product-detail/en/kemet/C0805C334K5RECAUTO/399-17888-1-ND/8640555; Device Package: 0805 (2012 Metric); LastUpdated: 9/2/2020 1:04:15 AM; Lifecycle Status: Active; Minimum Order: 1; Mounting Type: Surface Mount, MLCC; Operating Temperature: -55°C ~ 125°C; Package / Case: 0805 (2012 Metric); Packaging: TapeAndReel; PartId: 15715; Part Status: Active; Price: 0.05; Ratings: AEC-Q200; Series: ESD SMD Auto X7R; Size / Dimension: 0.079" L x 0.049" W (2.00mm x 1.25mm); Supplier 1: DigiKey; Supplier Part Number 1: 399-17888-1-ND; Temperature Coefficient: X7R; Thickness (Max): 0.039" (1.00mm); Tolerance: ±10%; Voltage - Rated: 50V
C47 = C0805X103K1RAC3316: CAP CER 0805 10NF 100V X7R; Manufacturer: KEMET; Capacitance: 10000pF; Tolerance: ±10%; Part Number: C0805X103K1RAC3316; Value: 10nf; Applications: Automotive, Boardflex Sensitive; ComponentLink1Description: Datasheet; ComponentLink1URL: https://api.kemet.com/component-edge/download/datasheet/C0805X103K1RAC3316.pdf; ComponentLink2Description: DigiKey Link; ComponentLink2URL: http://digikey.com/product-detail/en/kemet/C0805X103K1RAC3316/399-C0805X103K1RAC3316CT-ND/10315836; Device Package: 0805 (2012 Metric); Features: Soft Termination; LastUpdated: 9/2/2020 1:04:42 AM; Lifecycle Status: Active; Minimum Order: 1; Mounting Type: Surface Mount, MLCC; Operating Temperature: -55°C ~ 125°C; Package / Case: 0805 (2012 Metric); Packaging: TapeAndReel; PartId: 2565; Part Status: Active; Price: 0.02; Ratings: AEC-Q200; Series: SMD Auto X7R VW80808; Size / Dimension: 0.079" L x 0.049" W (2.00mm x 1.25mm); Supplier 1: DigiKey; Supplier Part Number 1: 399-C0805X103K1RAC3316CT-ND; Temperature Coefficient: X7R; Thickness (Max): 0.039" (0.98mm); Voltage - Rated: 100V
D13 = MMSZ3V6T1G: as D11 on sheet connections; Part Number: MMSZ3V6T1G; ComponentLink1Description: Datasheet; ComponentLink1URL: http://www.onsemi.com/pub/Collateral/MMSZ2V4T1-D.PDF; ComponentLink2Description: DigiKey Link; ComponentLink2URL: http://digikey.com/product-detail/en/on-semiconductor/MMSZ3V6T1G/MMSZ3V6T1GOSCT-ND/2121110; LastUpdated: 9/2/2020 1:19:27 AM; Lifecycle Status: Active; Minimum Order: 1; Mounting Type: Surface Mount; Operating Temperature: -55°C ~ 150°C; Package / Case: SOD-123; Packaging: TapeAndReel; PartId: 1892; Part Status: Active; Power - Max: 500mW; Price: 0.04; Series: -; Supplier 1: DigiKey; Supplier Part Number 1: MMSZ3V6T1GOSCT-ND; Supplier Device Package: SOD-123; Voltage - Zener (Nom) (Vz): 3.6V
FUSE1 = ATOF Fuse 3522: 3522 ATOF automotive fuse; Value: 25A
PAD1-PAD3 = Single Pad 4.5mm
R51 R52 = CSS2H-2512R-1L00FE: Res Metal Strip 2512 0.001 Ohm 1% 5W ±75ppm/°C Pad SMD Automotive T/R; Manufacturer: Bourns; Temperature Coefficient: 50ppm/°C; Supplier 1: Digi-Key; Manufacturer Part Number: CSS2H-2512R-1L00FE; RoHS: Yes; Category: Chip SMD Resistors; Stock 1: 1491; Pricing 1: 1=0.88000, 10=0.77500, 25=0.71240, 50=0.65000, 100=0.56250, 250=0.47500, 500=0.40000 (USD); Case/Package: 2512; Case Code (Imperial): 2512; Case Code (Metric): 6432; Min Operating Temperature: -55°C; Max Operating Temperature: 170°C; Resistor Type: Metal Element; Features: Moisture Resistant; Packaging: Tape and Reel; Resistance: 1mR; Tolerance: 1%; Max Power Dissipation: 5W; Number of Terminations: 2; RoHS Compliant: Yes; ComponentLink1URL: https://www.bourns.com/docs/Product-Datasheets/css2h-2512.pdf?src-supplier=Digi-Key; ComponentLink1Description: https://www.bourns.com/docs/Product-Datasheets/css2h-2512.pdf?src-supplier=Digi-Key
U9 = INA281B2IDBVR: Gain: 50V/V; ComponentLink1Description: New link; ComponentLink1URL: https://www.digikey.com/en/products/detail/texas-instruments/INA281B2IDBVR/13238583

## Nets that join several sheets
+3.3: controller (17 pins), power section (C33.1 D5.2 U7.1), connections (CON7.4 R42.2 R43.2 R50.2)
+5: controller (C1.2 R5.2 U1.2), power section (8 pins), connections (U8.20), current sense (C45.2 U9.3)
+20: power section (9 pins), connections (10 pins)
GND: controller (38 pins), power section (24 pins), connections (29 pins), current sense (C45.1 C47.1 D13.1 U9.2)
NetC44_2: controller (U2.12), connections (C44.2 CON8.1 D12.2 R50.1)
NetC47_2: controller (U2.10), current sense (C47.2 D13.2 U9.1)
NetCON7_1: controller (U2.34), connections (CON7.1)
NetCON7_3: controller (U2.37), connections (CON7.3)
NetD2_1: controller (R18.2), power section (D2.1 F1.2)
NetQ6_3: controller (U2.29), connections (Q6.3 R43.1)
NetR34_2: controller (U2.20), connections (R34.2)
NetR35_2: controller (U2.21), connections (R35.2)
NetR36_2: controller (U2.19), connections (R36.2)
NetR37_2: controller (U2.18), connections (R37.2)
USART_N: controller (U2.30), connections (U8.5)
USART_P: controller (U2.31), connections (U8.1)